# Altium schematic sheet APM32F103VET6核心板原理图.SchDoc
size A4
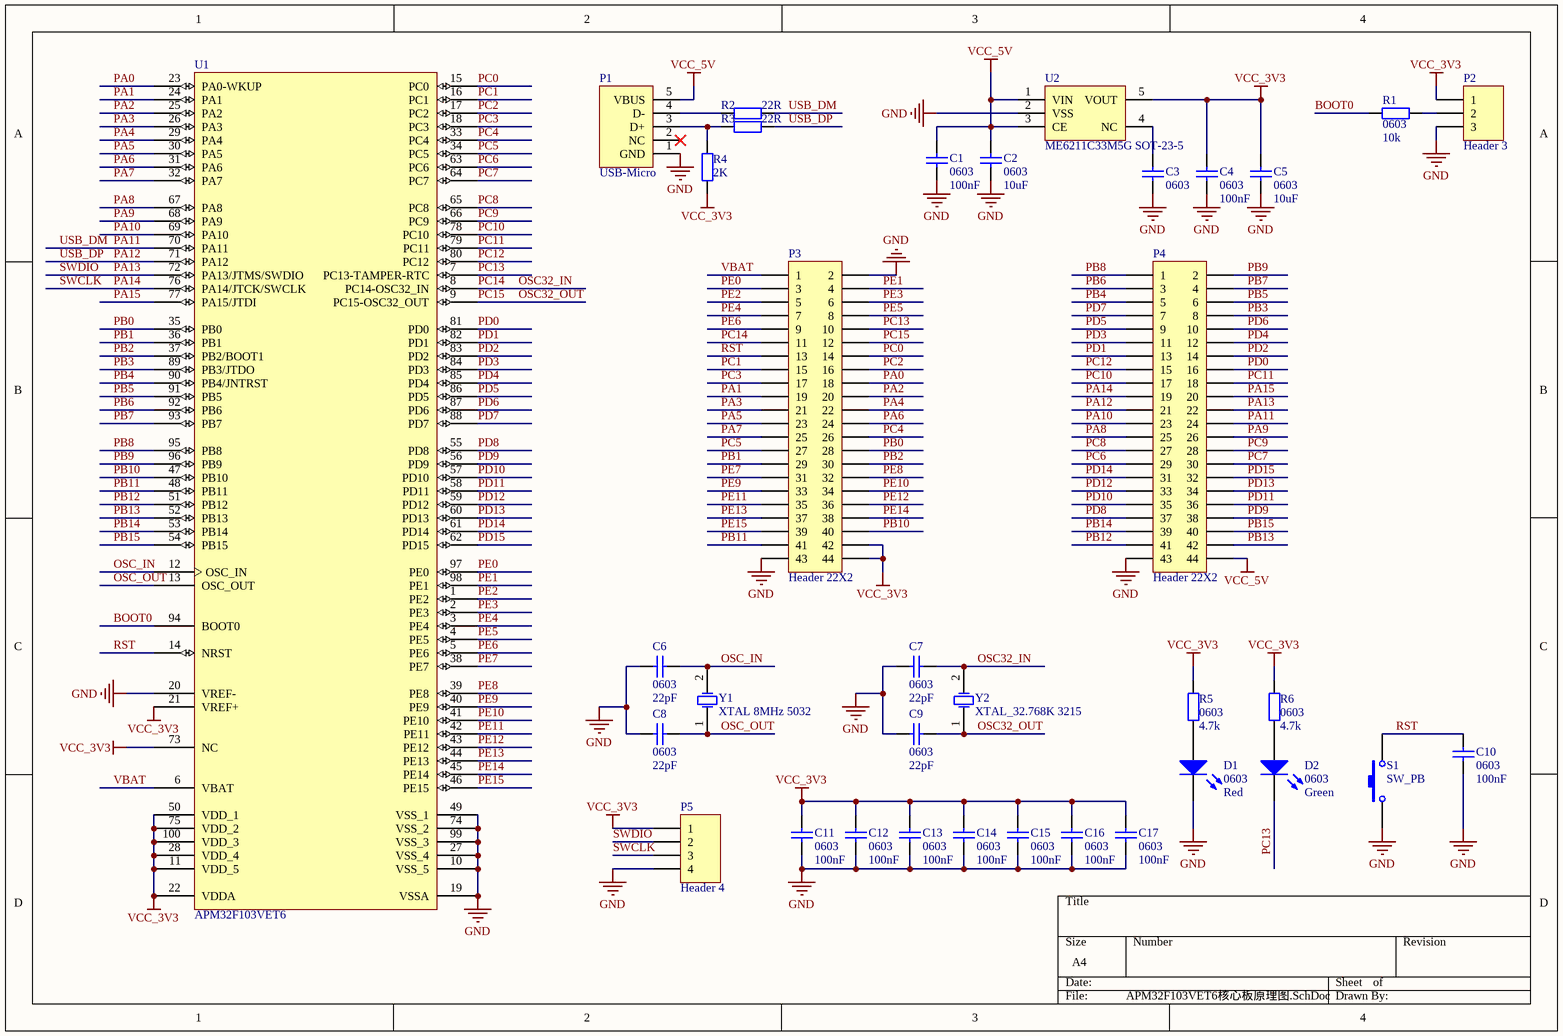
[diagram p0: APM32F103VET6核心板原理图.SchDoc]

## Parts
C1  value 100nF  footprint: 0603  [R0603-R/C-Y]  (hidden comment: Cap 0603)
C2  value 10uF  footprint: 0603  [R0603-R/C-Y]  (hidden comment: Cap 0603)
C3  footprint: 0603  [R0603-R/C-Y]  (hidden comment: Cap 0603)
C4  value 100nF  footprint: 0603  [R0603-R/C-Y]  (hidden comment: Cap 0603)
C5  value 10uF  footprint: 0603  [R0603-R/C-Y]  (hidden comment: Cap 0603)
C6  value 22pF  footprint: 0603  [R0603-R/C-Y]  (hidden comment: Cap 0603)
C7  value 22pF  footprint: 0603  [R0603-R/C-Y]  (hidden comment: Cap 0603)
C8  value 22pF  footprint: 0603  [R0603-R/C-Y]  (hidden comment: Cap 0603)
C9  value 22pF  footprint: 0603  [R0603-R/C-Y]  (hidden comment: Cap 0603)
C10  value 100nF  footprint: 0603  [R0603-R/C-Y]  (hidden comment: Cap 0603)
C11  value 100nF  footprint: 0603  [R0603-R/C-Y]  (hidden comment: Cap 0603)
C12  value 100nF  footprint: 0603  [R0603-R/C-Y]  (hidden comment: Cap 0603)
C13  value 100nF  footprint: 0603  [R0603-R/C-Y]  (hidden comment: Cap 0603)
C14  value 100nF  footprint: 0603  [R0603-R/C-Y]  (hidden comment: Cap 0603)
C15  value 100nF  footprint: 0603  [R0603-R/C-Y]  (hidden comment: Cap 0603)
C16  value 100nF  footprint: 0603  [R0603-R/C-Y]  (hidden comment: Cap 0603)
C17  value 100nF  footprint: 0603  [R0603-R/C-Y]  (hidden comment: Cap 0603)
D1  value Red  Footprint: 0603  [0603-LED-G]  (hidden comment: LED 0603)
D2  value Green  Footprint: 0603  [0603-LED-G]  (hidden comment: LED 0603)
P1  USB-Micro  [USB Micro]
P2  Header 3  [HDR1X3]
P3  Header 22X2  [HDR2X22]
P4  Header 22X2  [HDR2X22]
P5  Header 4  [HDR1X4]
R1  value 10k  Footprint: 0603  [R0603-R/C-BY]  (hidden comment: Res 0603)
R2  value 22R  [R0603-R/C-BY]  (hidden comment: Res 0603)
R3  value 22R  [R0603-R/C-BY]  (hidden comment: Res 0603)
R4  value 2K  [R0603-R/C-BY]  (hidden comment: Res 0603)
R5  value 4.7k  Footprint: 0603  [R0603-R/C-BY]  (hidden comment: Res 0603)
R6  value 4.7k  Footprint: 0603  [R0603-R/C-BY]  (hidden comment: Res 0603)
S1  SW_PB  [SW-2Pin]
U1  APM32F103VET6  [LQFP100_M]
U2  ME6211C33M5G SOT-23-5  [SOT-23-5]
Y1  XTAL 8MHz 5032  [XTAL 5032]
Y2  XTAL_32.768K 3215  [XTAL 3215]

## Nets
GND: C1.1 C2.1 C3.1 C4.1 C5.1 C6.2 C7.2 C8.2 C9.2 C10.1 C11.1 C12.1 C13.1 C14.1 C15.1 C16.1 C17.1 D1.2(K) P1.1(GND) P2.3 P3.2 P3.43 P4.43 P5.4 S1.1 U1.10(VSS_5) U1.19(VSSA) U1.20(VREF-) U1.27(VSS_4) U1.49(VSS_1) U1.74(VSS_2) U1.99(VSS_3) U2.2(VSS)
VCC_3V3: C4.2 C5.2 C11.2 C12.2 C13.2 C14.2 C15.2 C16.2 C17.2 P2.1 P3.42 P3.44 P5.1 R4.1 R5.1 R6.1 U1.11(VDD_5) U1.21(VREF+) U1.22(VDDA) U1.28(VDD_4) U1.50(VDD_1) U1.73(NC) U1.75(VDD_2) U1.100(VDD_3) U2.5(VOUT)
VCC_5V: C1.2 C2.2 P1.5(VBUS) P4.44 U2.1(VIN) U2.3(CE)
BOOT0: R1.1 U1.94(BOOT0)
OSC32_IN: C7.1 P3.11 U1.8(PC14-OSC32_IN) Y2.2(OSC2)  [also labelled PC14]
OSC32_OUT: C9.1 P3.12 U1.9(PC15-OSC32_OUT) Y2.1(OSC1)  [also labelled PC15]
OSC_IN: C6.1 U1.12(OSC_IN) Y1.2(OSC2)
OSC_OUT: C8.1 U1.13(OSC_OUT) Y1.1(OSC1)
PA0: P3.18 U1.23(PA0-WKUP)
PA1: P3.19 U1.24(PA1)
PA2: P3.20 U1.25(PA2)
PA3: P3.21 U1.26(PA3)
PA4: P3.22 U1.29(PA4)
PA5: P3.23 U1.30(PA5)
PA6: P3.24 U1.31(PA6)
PA7: P3.25 U1.32(PA7)
PA8: P4.25 U1.67(PA8)
PA9: P4.26 U1.68(PA9)
PA10: P4.23 U1.69(PA10)
PA11: P4.24 R2.2 U1.70(PA11)  [also labelled USB_DM]
PA12: P4.21 R3.2 U1.71(PA12)  [also labelled USB_DP]
PA13: P4.22 P5.2 U1.72(PA13/JTMS/SWDIO)  [also labelled SWDIO]
PA14: P4.19 P5.3 U1.76(PA14/JTCK/SWCLK)  [also labelled SWCLK]
PA15: P4.20 U1.77(PA15/JTDI)
PB0: P3.28 U1.35(PB0)
PB1: P3.29 U1.36(PB1)
PB2: P3.30 U1.37(PB2/BOOT1)
PB3: P4.8 U1.89(PB3/JTDO)
PB4: P4.5 U1.90(PB4/JNTRST)
PB5: P4.6 U1.91(PB5)
PB6: P4.3 U1.92(PB6)
PB7: P4.4 U1.93(PB7)
PB8: P4.1 U1.95(PB8)
PB9: P4.2 U1.96(PB9)
PB10: P3.40 U1.47(PB10)
PB11: P3.41 U1.48(PB11)
PB12: P4.41 U1.51(PB12)
PB13: P4.42 U1.52(PB13)
PB14: P4.39 U1.53(PB14)
PB15: P4.40 U1.54(PB15)
PC0: P3.14 U1.15(PC0)
PC1: P3.15 U1.16(PC1)
PC2: P3.16 U1.17(PC2)
PC3: P3.17 U1.18(PC3)
PC4: P3.26 U1.33(PC4)
PC5: P3.27 U1.34(PC5)
PC6: P4.29 U1.63(PC6)
PC7: P4.30 U1.64(PC7)
PC8: P4.27 U1.65(PC8)
PC9: P4.28 U1.66(PC9)
PC10: P4.17 U1.78(PC10)
PC11: P4.18 U1.79(PC11)
PC12: P4.15 U1.80(PC12)
PC13: D2.2(K) P3.10 U1.7(PC13-TAMPER-RTC)
PD0: P4.16 U1.81(PD0)
PD1: P4.13 U1.82(PD1)
PD2: P4.14 U1.83(PD2)
PD3: P4.11 U1.84(PD3)
PD4: P4.12 U1.85(PD4)
PD5: P4.9 U1.86(PD5)
PD6: P4.10 U1.87(PD6)
PD7: P4.7 U1.88(PD7)
PD8: P4.37 U1.55(PD8)
PD9: P4.38 U1.56(PD9)
PD10: P4.35 U1.57(PD10)
PD11: P4.36 U1.58(PD11)
PD12: P4.33 U1.59(PD12)
PD13: P4.34 U1.60(PD13)
PD14: P4.31 U1.61(PD14)
PD15: P4.32 U1.62(PD15)
PE0: P3.3 U1.97(PE0)
PE1: P3.4 U1.98(PE1)
PE2: P3.5 U1.1(PE2)
PE3: P3.6 U1.2(PE3)
PE4: P3.7 U1.3(PE4)
PE5: P3.8 U1.4(PE5)
PE6: P3.9 U1.5(PE6)
PE7: P3.31 U1.38(PE7)
PE8: P3.32 U1.39(PE8)
PE9: P3.33 U1.40(PE9)
PE10: P3.34 U1.41(PE10)
PE11: P3.35 U1.42(PE11)
PE12: P3.36 U1.43(PE12)
PE13: P3.37 U1.44(PE13)
PE14: P3.38 U1.45(PE14)
PE15: P3.39 U1.46(PE15)
RST: C10.2 P3.13 S1.2 U1.14(NRST)
VBAT: P3.1 U1.6(VBAT)
NetC3_2: C3.2 U2.4(NC)
NetD1_1: D1.1(A) R5.2
NetD2_1: D2.1(A) R6.2
NetP1_3: P1.3(D+) R3.1 R4.2
NetP1_4: P1.4(D-) R2.1
NetP2_2: P2.2 R1.2

Not connected (* = marked no-connect by the designer): P1 2(NC)*

## Library data of the parts
C1 C2 C4-C17 = Cap 0603: Capacitor 0603
C3 = Cap 0603: Capacitor 0603; value: 100nF
P2 = Header 3: Header, 3-Pin; LatestRevisionDate: 17-Jul-2002; LatestRevisionNote: Re-released for DXP Platform.; Publisher: Altium Limited
P3 P4 = Header 22X2: Header, 22-Pin, Dual row; LatestRevisionDate: 17-Jul-2002; LatestRevisionNote: Re-released for DXP Platform.; Publisher: Altium Limited
P5 = Header 4: Header, 4-Pin; LatestRevisionDate: 17-Jul-2002; LatestRevisionNote: Re-released for DXP Platform.; Publisher: Altium Limited
R1-R6 = Res 0603: Resistor 0603
  R2-R4: Footprint: 0603
U1 = STM32F103VBT6: STM32 ARM-based 32-bit MCU with 64 Kbytes Flash, 100-pin LQFP, Industrial Temperature; Published: 30-May-2008; DatasheetVersion: rev6, Mar-2008; PackageVersion: Mar-2008; PackageReference: LQFP100; Publisher: Altium Limited; PackageDescription: 100-Pin Low-Profile Quad Flat Pack, 14 x 14 mm Body, 0.5 mm Pitch (LQFP100); ComponentLink1Description: Manufacturer Link; ComponentLink1URL: www.st.com/stm32; ComponentLink2Description: Datasheet; ComponentLink2URL: http://www.st.com/stonline/products/literature/ds/13587.pdf
U2 = ME6211C33M5G
Y1 = XTAL 8MHZ